# Altium project G-Board-G070.PrjPcb
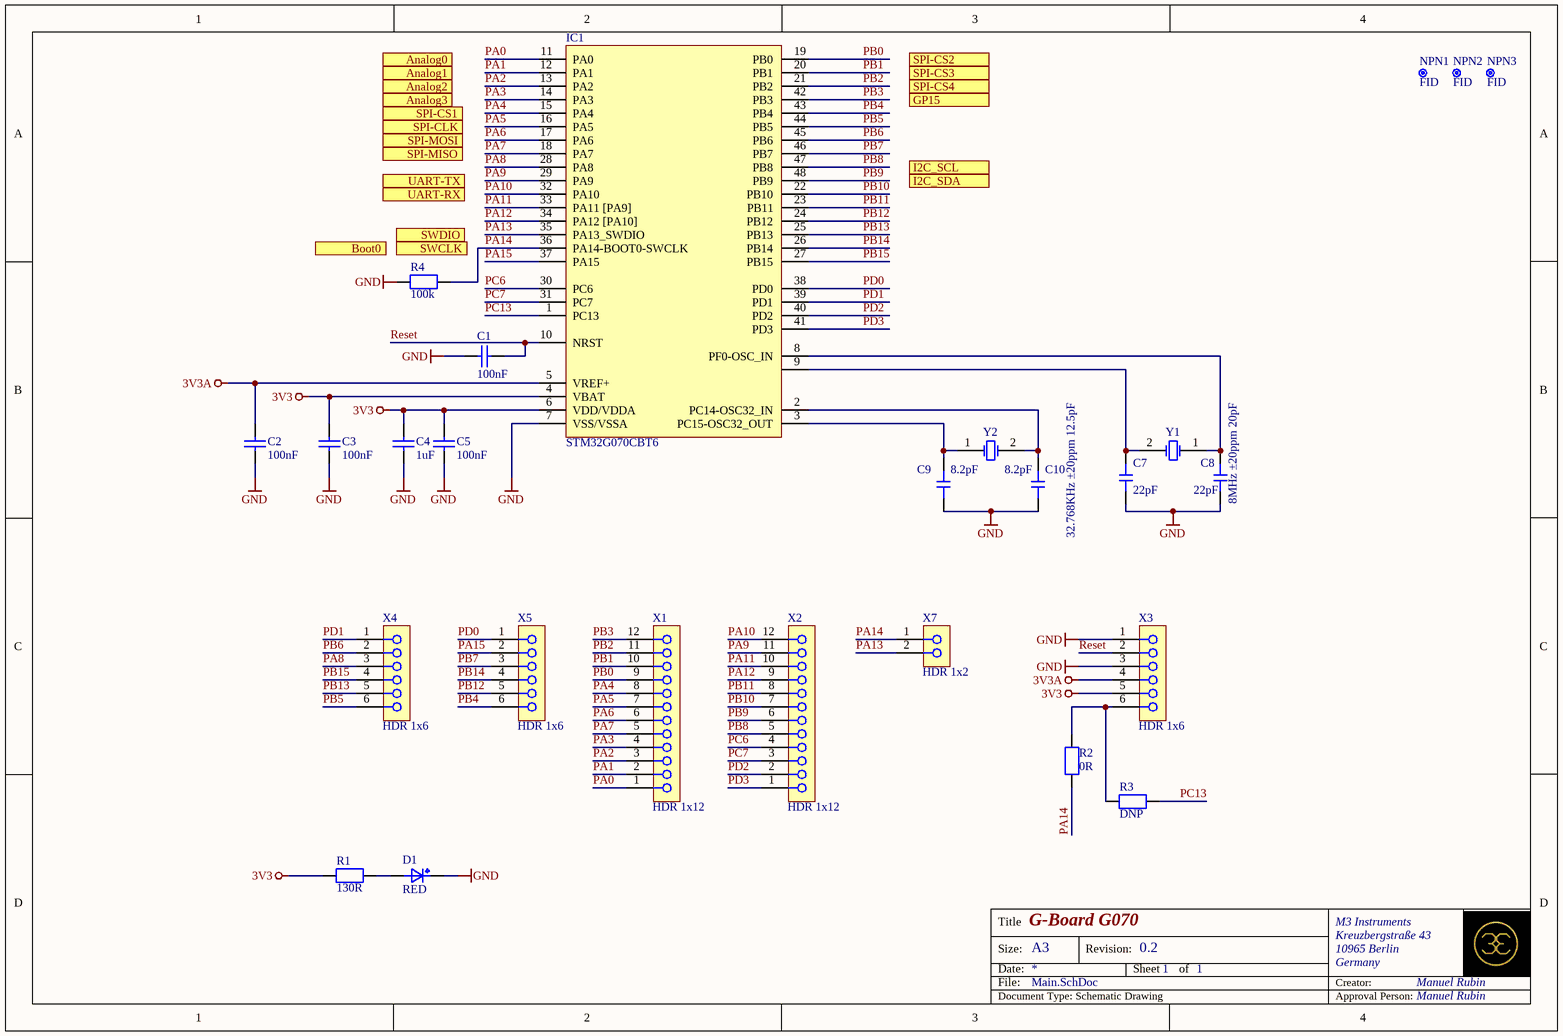
[diagram p0: Main.SchDoc]
address2: Kreuzbergstraße 43; address3: 10965 Berlin; address4: Germany; ApprovalSchematic: Manuel Rubin; CompanyName: M3 Instruments; CreatorSchematic: Manuel Rubin; ProjectRevision: 0.2
1 sheet, 26 parts. Net scope: flat (ports and power ports of the same name join across sheets).
Board file: erb-pcb0002.PcbDoc

## Sheet Main.SchDoc: G-Board G070
size A4; Author: Manuel Koch; DrawnBy: Manuel Koch; DocumentNumber: erb-pcb0001; Revision: 0.1; SheetNumber: 1; SheetTotal: 1; ImagePath: 1

### Parts
C1  100nF  [CAPC1005X55]
C2  100nF  [CAPC1005X55]
C3  100nF  [CAPC1005X55]
C4  1uF  [CAPC1005X55]
C5  100nF  [CAPC1005X55]
C7  22pF  [CAPC1608X95N]
C8  22pF  [CAPC1608X95N]
C9  8.2pF  [CAPC1608X95N]
C10  8.2pF  [CAPC1608X95N]
D1  RED  [WL-SMCW_0805]
IC1  STM32G070CBT6  [LQFP-48_7x7x05P]
NPN1  FID  [Fiducial_1mm]
NPN2  FID  [Fiducial_1mm]
NPN3  FID  [Fiducial_1mm]
R1  130R  [RESC2012X70N]
R2  0R  [RESC1608X55N]
R3  DNP  [RESC1608X55N]  (no BOM)
R4  100k  [RESC1005X40N]
X1  HDR 1x12  [61301211121_no]
X2  HDR 1x12  [61301211121_no]
X3  HDR 1x6  [61300611121_no]
X4  HDR 1x6  [61300611121_no]
X5  HDR 1x6  [61300611121_no]
X7  HDR 1x2  [CON_HEADER2.54_1x2W_no]
Y1  8MHz ±20ppm 20pF  [SMD-5032_2P]
Y2  32.768KHz ±20ppm 12.5pF  [SMD-3215_2P FC - 135]

### Ports
Analog0, Analog1, Analog2, Analog3, Boot0, GP15, I2C_SCL, I2C_SDA, SPI-CLK, SPI-CS1, SPI-CS2, SPI-CS3, SPI-CS4, SPI-MISO, SPI-MOSI, SWCLK, SWDIO, UART-RX, UART-TX

### Nets
3V3: C3.2 C4.2 C5.2 IC1.4(VBAT) IC1.6(VDD/VDDA) R1.1 X3.5
3V3A: C2.2 IC1.5(VREF+) X3.4
GND: C1.2 C2.1 C3.1 C4.1 C5.1 C7.2 C8.2 C9.1 C10.1 D1.K IC1.7(VSS/VSSA) R4.2 X3.1 X3.3
PA0: IC1.11(PA0) X1.1
PA1: IC1.12(PA1) X1.2
PA2: IC1.13(PA2) X1.3
PA3: IC1.14(PA3) X1.4
PA4: IC1.15(PA4) X1.8
PA5: IC1.16(PA5) X1.7
PA6: IC1.17(PA6) X1.6
PA7: IC1.18(PA7) X1.5
PA8: IC1.28(PA8) X4.3
PA9: IC1.29(PA9) X2.11
PA10: IC1.32(PA10) X2.12
PA11: IC1.33(PA11_[PA9]) X2.10
PA12: IC1.34(PA12_[PA10]) X2.9
PA13: IC1.35(PA13_SWDIO) X7.2
PA14: IC1.36(PA14-BOOT0-SWCLK) R2.1 R4.1 X7.1
PA15: IC1.37(PA15) X5.2
PB0: IC1.19(PB0) X1.9
PB1: IC1.20(PB1) X1.10
PB2: IC1.21(PB2) X1.11
PB3: IC1.42(PB3) X1.12
PB4: IC1.43(PB4) X5.6
PB5: IC1.44(PB5) X4.6
PB6: IC1.45(PB6) X4.2
PB7: IC1.46(PB7) X5.3
PB8: IC1.47(PB8) X2.5
PB9: IC1.48(PB9) X2.6
PB10: IC1.22(PB10) X2.7
PB11: IC1.23(PB11) X2.8
PB12: IC1.24(PB12) X5.5
PB13: IC1.25(PB13) X4.5
PB14: IC1.26(PB14) X5.4
PB15: IC1.27(PB15) X4.4
PC6: IC1.30(PC6) X2.4
PC7: IC1.31(PC7) X2.3
PC13: IC1.1(PC13) R3.2
PD0: IC1.38(PD0) X5.1
PD1: IC1.39(PD1) X4.1
PD2: IC1.40(PD2) X2.2
PD3: IC1.41(PD3) X2.1
Reset: C1.1 IC1.10(NRST) X3.2
NetC7_1: C7.1 IC1.9(PF1-OSC_OU'T) Y1.2(OSC2)
NetC8_1: C8.1 IC1.8(PF0-OSC_IN) Y1.1(OSC1)
NetC9_2: C9.2 IC1.3(PC15-OSC32_OUT) Y2.1(OSC1)
NetC10_2: C10.2 IC1.2(PC14-OSC32_IN) Y2.2(OSC2)
NetD1_A: D1.A R1.2
NetR2_2: R2.2 R3.1 X3.6

### Notes on the sheet
- Title
- Size:
- Date:
- File:
- A3
- Revision:
- Sheet
- of
- Creator:
- Document Type: Schematic Drawing
- Approval Person:

### Library data of the parts
C1-C3 C5 = CAP_100nF_0402: X7R 100nF ±10% 16V 0402 Multilayer Ceramic Capacitors MLCC - SMD/SMT ROHS; Manufacturer: Samsung Electro-Mechanics; Manufacturer Part Number: CL05B104KO5NNNC; Voltage Rating: 16VDC; Alternatives allowed: yes; Tolerance: 10%; JLC: C1525
C4 = CAP_1uF_0402: X5R 25V ±10% 1uF 0402 Multilayer Ceramic Capacitors MLCC - SMD/SMT ROHS; Manufacturer: Samsung Electro-Mechanics; Manufacturer Part Number: CL05A105KA5NQNC; Alternatives allowed: yes; Voltage Rating: 25V; Tolerance: 10%; JLC: C52923
C7 C8 = CAP_22pF_50V_0603: Chip capacitors; Manufacturer: Samsung Electro-Mechanics; Manufacturer Part Number: CL10C220JB8NNNC; Voltage Rating: 50V; Alternatives allowed: YES; Notes: C0G, 0402; JLC: C1653
C9 C10 = CAP_8p2_50V_0603: Multilayer Ceramic Capacitors MLCC - SMD/SMT 0402 8.0pF 50volts C0G +/-0.5pF; Manufacturer: Guangdong Fenghua Advanced Tech; Manufacturer Part Number: 0603CG8R2C500NT; Voltage Rating: 50V; Alternatives allowed: YES; Notes: C0G, 0402; JLC: C1685
D1 = LED_0805_RED_AK: Standard LEDs - SMD WL-SMCW SMDMono TpVw Waterclr 0805 Red; Manufacturer: Wurth Elektronik; Manufacturer Part Number: 150080RS75000; Voltage Rating: 2.0; Alternatives allowed: YES; JLC: C84256
IC1 = STM32G070CBT6: ARM Mikrocontroller - MCU Mainstream Value line, Arm Cortex-M0+ MCU 128 Kbytes of Flash 36 Kbytes RAM, 64; Manufacturer: STMicroelectronics; ComponentLink1Description: 供应商链接; ComponentLink1URL: http://www.szlcsc.com/product/details_9243.html; Manufacturer Part Number: STM32G070CBT6; JLC: C529338
NPN1-NPN3 = Fiducial_1mm
R1 = RES_130R_0805: Dickfilmwiderstände - SMD 1/8watt 130ohms 1% 100ppm; Manufacturer: Vishay / Dale; Manufacturer Part Number: CRCW0805130RFKEA; Voltage Rating: 150V; Alternatives allowed: YES; Tolerance: 1%; JLC: C17437
R2 = RES_0R_0603: Thick Film Resistors - SMD 1/10watt ZEROohm Jumper; Manufacturer: Vishay; Manufacturer Part Number: CRCW06030000Z0EA; Voltage Rating: 75V; Tolerance: 1%; Alternatives allowed: YES; JLC: C21189
R3 = RES_DNF_0603: Resistor SMD 0603 - not populated; Notes: not populated
R4 = RES_100k_0402: Thick Film Resistors - SMD 63mW 100Kohms 1%; Manufacturer: Vishay; Manufacturer Part Number: RC0402FR-07100KL; Voltage Rating: 50V; Alternatives allowed: YES; Tolerance: 1%; JLC: C60491
X1 X2 = CON_HEADER_1X12_no_overlay: Board-to-Board-Steckverbinder, 2.54 mm, 12 Kontakt(e), Stiftleiste 1-Reihig; Manufacturer: WE; Manufacturer Part Number: 61301211121; Alternatives allowed: YES
X3-X5 = CON_HEADER_1X6_no_overlay: Board-to-Board-Steckverbinder, 2.54 mm, 6 Kontakt(e), Stiftleiste 1-Reihig; Manufacturer: WE; Manufacturer Part Number: 61300611121; Alternatives allowed: YES
X7 = CON_HEADER_1X2_no_overlay: Board-to-Board-Steckverbinder, 2.54 mm, 2 Kontakt(e), Stiftleiste 1-Reihig; Manufacturer: Samtec; Manufacturer Part Number: TSW-102-07-T-S; Lumira Part Number: S-QMS-SPEC-32507; Alternatives allowed: YES
Y1 = SMD-5032_2P 8MHz 20ppm 20pF: 8MHz SMD Crystal Resonator 20pF ±10ppm ±50ppm -40℃~+85℃ SMD5032-2P Crystals ROHS; Manufacturer: Yangxing Tech; Manufacturer Part Number: X50328MSB2GI; ComponentLink1Description: 供应商链接; ComponentLink1URL: http://www.szlcsc.com/product/details_117214.html; Package: SMD-5032_2P; JLC: C115962
Y2 = SMD-3215_2P 32.768KHz 20ppm 12.5pF: 32.768kHz SMD Crystal Resonator 12.5pF 70kΩ ±20ppm -40℃~+85℃ SMD3215-2P Crystals ROHS; Manufacturer: Seiko Epson; Manufacturer Part Number: Q13FC1350000400; ComponentLink1Description: 供应商链接; ComponentLink1URL: http://www.szlcsc.com/product/details_33310.html; Package: SMD-3215_2P; Supplier: LC; JLC: C32346